# Altium project CompassIO_Rev2.PrjPcb
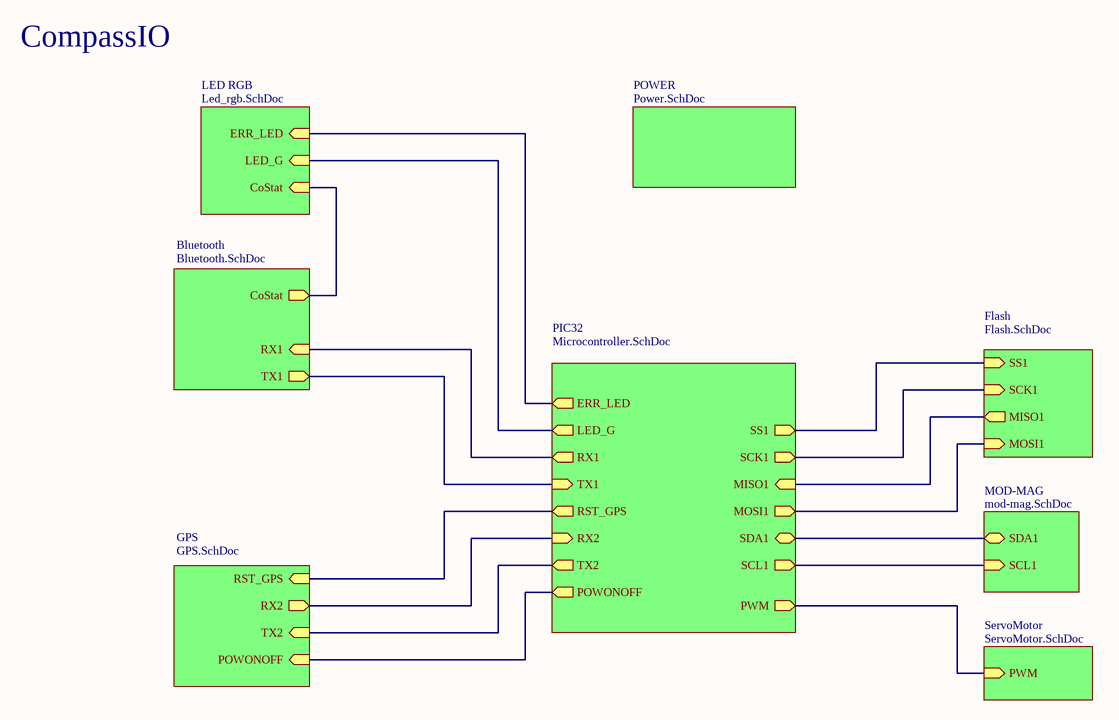
[diagram p0: CompassIO.SchDoc]
9 sheets, 58 parts. Net scope: hierarchical (ports join the sheet entries above them; power ports are global).
Board file: PCB2.PcbDoc
Sheets:
  CompassIO.SchDoc
    Bluetooth = Bluetooth.SchDoc
    PIC32 = Microcontroller.SchDoc
    GPS = GPS.SchDoc
    MOD-MAG = mod-mag.SchDoc
    Flash = Flash.SchDoc
    ServoMotor = ServoMotor.SchDoc
    LED RGB = Led_rgb.SchDoc
    POWER = Power.SchDoc

## Sheet CompassIO.SchDoc
size A4; SheetNumber: 0

### Sub-sheets
Bluetooth = Bluetooth.SchDoc: CoStat (out), RX1 (in), TX1 (out)
Flash = Flash.SchDoc: SS1 (in), SCK1 (in), MISO1 (out), MOSI1 (in)
GPS = GPS.SchDoc: RST_GPS (in), TX2 (in), RX2 (out), POWONOFF (in)
LED RGB = Led_rgb.SchDoc: LED_G (in), CoStat (in), ERR_LED (in)
MOD-MAG = mod-mag.SchDoc: SDA1 (bidir), SCL1 (in)
PIC32 = Microcontroller.SchDoc: POWONOFF (out), RX2 (in), TX2 (out), RST_GPS (out), LED_G (out), RX1 (out), TX1 (in), SS1 (out), SCK1 (out), MISO1 (in), MOSI1 (out), SDA1 (bidir), PWM (out), SCL1 (out), ERR_LED (out)
POWER = Power.SchDoc: no entries
ServoMotor = ServoMotor.SchDoc: PWM (in)

### Nets
NetJ2_13: sheet Bluetooth/TX1, sheet PIC32/TX1
NetJ2_14: sheet Bluetooth/RX1, sheet PIC32/RX1
NetJ2_21: sheet Bluetooth/CoStat, sheet LED RGB/CoStat
NetJ4_5: sheet PIC32/SCL1, sheet MOD-MAG/SCL1
NetJ4_6: sheet PIC32/SDA1, sheet MOD-MAG/SDA1
NetJ5_1: sheet PIC32/RST_GPS, sheet GPS/RST_GPS
NetJ5_18: sheet PIC32/POWONOFF, sheet GPS/POWONOFF
NetJ5_20: sheet PIC32/RX2, sheet GPS/RX2
NetJ5_21: sheet PIC32/TX2, sheet GPS/TX2
NetM1_3: sheet PIC32/PWM, sheet ServoMotor/PWM
NetR12_1: sheet PIC32/LED_G, sheet LED RGB/LED_G
NetR13_1: sheet PIC32/ERR_LED, sheet LED RGB/ERR_LED
NetU1_22: sheet PIC32/MISO1, sheet Flash/MISO1
NetU1_24: sheet PIC32/MOSI1, sheet Flash/MOSI1
NetU1_25: sheet PIC32/SCK1, sheet Flash/SCK1
NetU1_26: sheet PIC32/SS1, sheet Flash/SS1

### Notes on the sheet
- CompassIO

## Sheet Bluetooth.SchDoc
size A4; SheetNumber: 3
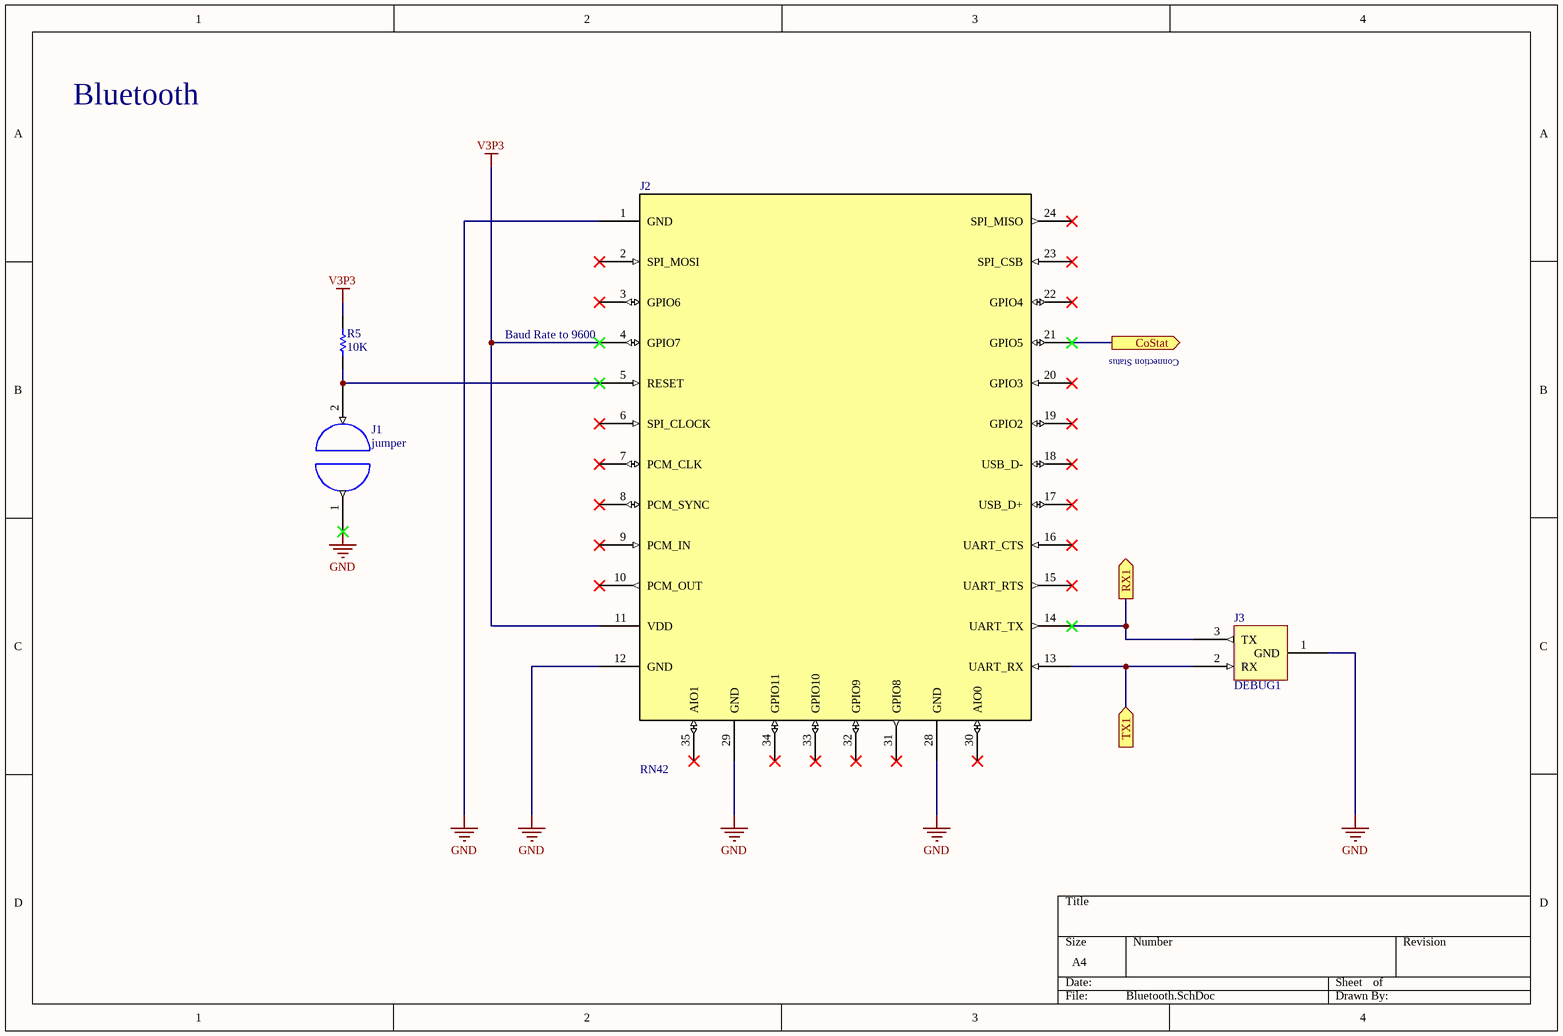
[diagram p1: Bluetooth.SchDoc]

### Parts
J1  jumper  [jumper 254]
J2  RN42  [RN42]
J3  DEBUG1  [DEBUG3]
R5  10K  [own_0603]

### Ports
CoStat (out), RX1 (out), TX1 (in)

### Nets
GND: J1.1 J2.1(GND) J2.12(GND) J2.28(GND) J2.29(GND) J3.1(GND)
V3P3: J2.4(GPIO7) J2.11(VDD) R5.2
NetJ1_2: J1.2 J2.5(RESET) R5.1
NetJ2_13: J2.13(UART_RX) J3.2(RX) ; port TX1
NetJ2_14: J2.14(UART_TX) J3.3(TX) ; port RX1
NetJ2_21: J2.21(GPIO5) ; port CoStat

Not connected (* = marked no-connect by the designer): J2 2(SPI_MOSI)* 3(GPIO6)* 6(SPI_CLOCK)* 7(PCM_CLK)* 8(PCM_SYNC)* 9(PCM_IN)* 10(PCM_OUT)* 15(UART_RTS)* 16(UART_CTS)* 17(USB_D+)* 18(USB_D-)* 19(GPIO2)* 20(GPIO3)* 22(GPIO4)* 23(SPI_CSB)* 24(SPI_MISO)* 30(AIO0)* 31(GPIO8)* 32(GPIO9)* 33(GPIO10)* 34(GPIO11)* 35(AIO1)*

### Notes on the sheet
- Bluetooth
- (near J2) Baud Rate to 9600
- Connection Status

### Library data of the parts
J2 = RN42: Bluetooth Module; Fabricant: Microchip; RefFabricant: RN42-I/RM; Fournisseur: Farnell; RefFournisseur: 2143310
J3 = TTL_Debug_3: Debug interface
R5 = Res1: Resistor; Fournisseur: Farnell; Fabricant: PANASONIC ELECTRONIC COMPONENTS; RefFabricant: ERA3ARW103V; RefFournisseur: 1688472

## Sheet Microcontroller.SchDoc
size A4; SheetNumber: 1
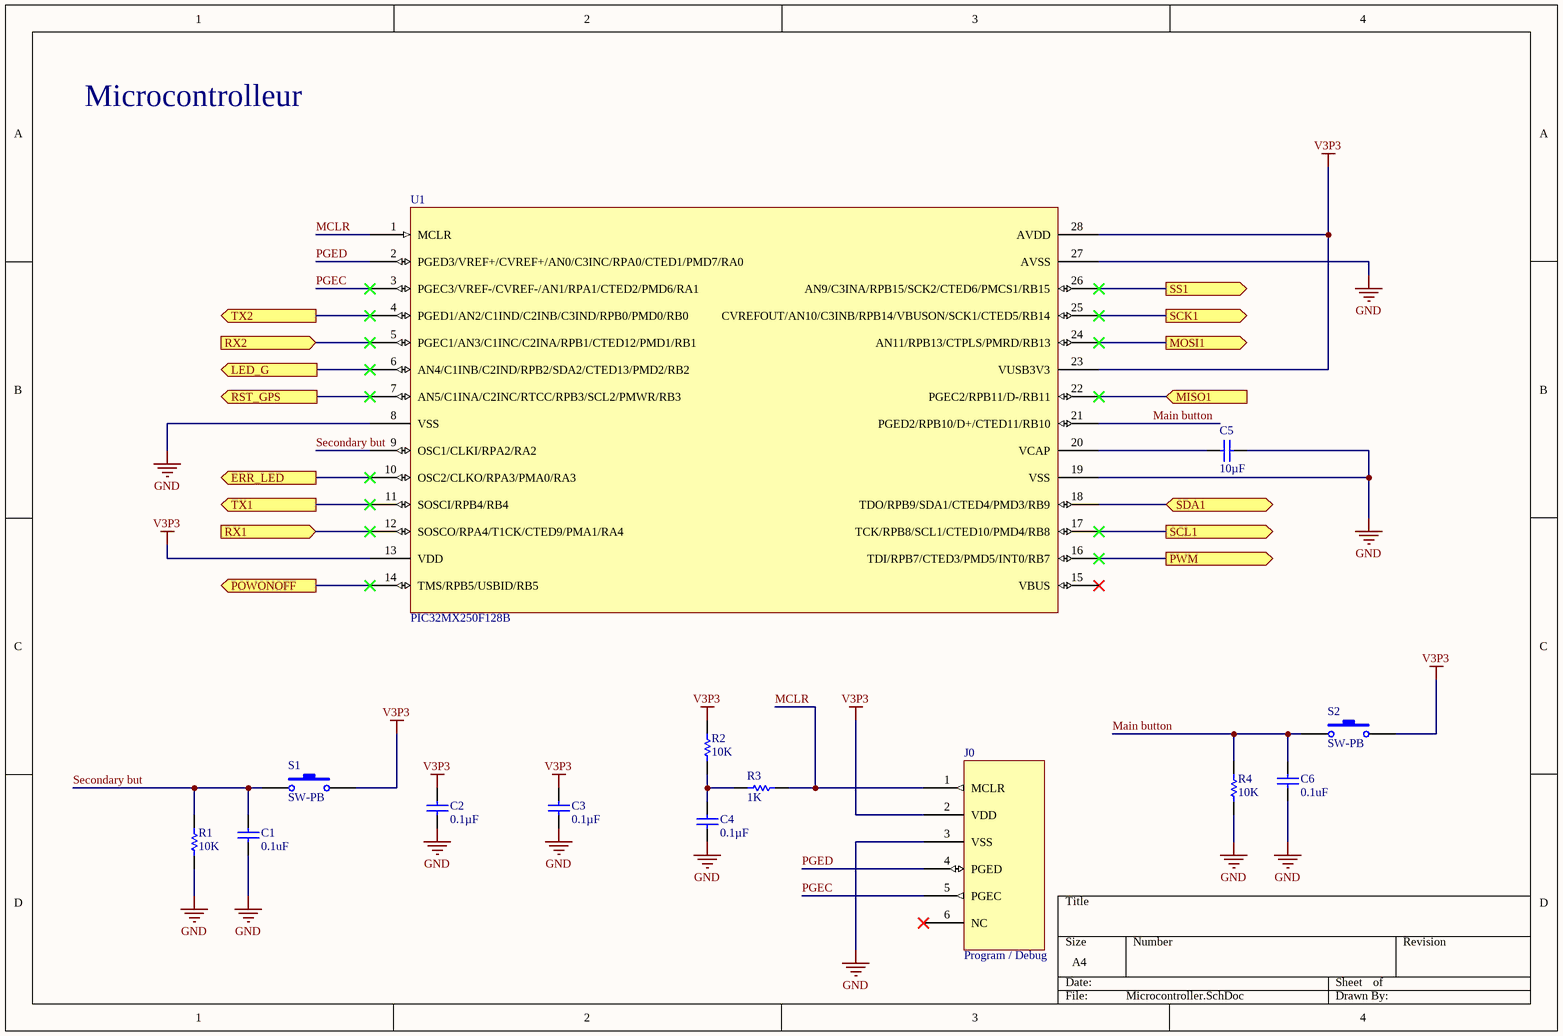
[diagram p2: Microcontroller.SchDoc]

### Parts
C1  0.1uF  [own_0603]
C2  0.1µF  [own_0603]
C3  0.1µF  [own_0603]
C4  0.1µF  [own_0603]
C5  10µF  [own_0603]
C6  0.1uF  [own_0603]
J0  Program / Debug  [C-Grid III X6]
R1  10K  [own_0603]
R2  10K  [own_0603]
R3  1K  [own_0603]
R4  10K  [own_0603]
S1  SW-PB  [SWTCH 1]
S2  SW-PB  [SWTCH 1]
U1  PIC32MX250F128B  [PIC32MX250F128/SO]

### Ports
ERR_LED (out), LED_G (out), MISO1 (in), MOSI1 (out), POWONOFF (out), PWM (out), RST_GPS (out), RX1 (in), RX2 (in), SCK1 (out), SCL1 (out), SDA1 (bidir), SS1 (out), TX1 (out), TX2 (out)

### Nets
GND: C1.1 C2.1 C3.1 C4.1 C5.1 C6.1 J0.3(VSS) R1.1 R4.1 U1.8(VSS) U1.19(VSS) U1.27(AVSS)
V3P3: C2.2 C3.2 J0.2(VDD) R2.2 S1.2 S2.2 U1.13(VDD) U1.23(VUSB3V3) U1.28(AVDD)
Main button: C6.2 R4.2 S2.1 U1.21(PGED2/RPB10/D+/CTED11/RB10)
MCLR: J0.1(MCLR) R3.2 U1.1(MCLR)
PGEC: J0.5(PGEC) U1.3(PGEC3/VREF-/CVREF-/AN1/RPA1/CTED2/PMD6/RA1)
PGED: J0.4(PGED) U1.2(PGED3/VREF+/CVREF+/AN0/C3INC/RPA0/CTED1/PMD7/RA0)
Secondary but: C1.2 R1.2 S1.1 U1.9(OSC1/CLKI/RPA2/RA2)
NetC4_2: C4.2 R2.1 R3.1
NetC5_2: C5.2 U1.20(VCAP)
NetJ2_13: U1.11(SOSCI/RPB4/RB4) ; port TX1
NetJ2_14: U1.12(SOSCO/RPA4/T1CK/CTED9/PMA1/RA4) ; port RX1
NetJ4_5: U1.17(TCK/RPB8/SCL1/CTED10/PMD4/RB8) ; port SCL1
NetJ4_6: U1.18(TDO/RPB9/SDA1/CTED4/PMD3/RB9) ; port SDA1
NetJ5_1: U1.7(AN5/C1INA/C2INC/RTCC/RPB3/SCL2/PMWR/RB3) ; port RST_GPS
NetJ5_18: U1.14(TMS/RPB5/USBID/RB5) ; port POWONOFF
NetJ5_20: U1.5(PGEC1/AN3/C1INC/C2INA/RPB1/CTED12/PMD1/RB1) ; port RX2
NetJ5_21: U1.4(PGED1/AN2/C1IND/C2INB/C3IND/RPB0/PMD0/RB0) ; port TX2
NetM1_3: U1.16(TDI/RPB7/CTED3/PMD5/INT0/RB7) ; port PWM
NetR12_1: U1.6(AN4/C1INB/C2IND/RPB2/SDA2/CTED13/PMD2/RB2) ; port LED_G
NetR13_1: U1.10(OSC2/CLKO/RPA3/PMA0/RA3) ; port ERR_LED
NetU1_22: U1.22(PGEC2/RPB11/D-/RB11) ; port MISO1
NetU1_24: U1.24(AN11/RPB13/CTPLS/PMRD/RB13) ; port MOSI1
NetU1_25: U1.25(CVREFOUT/AN10/C3INB/RPB14/VBUSON/SCK1/CTED5/RB14) ; port SCK1
NetU1_26: U1.26(AN9/C3INA/RPB15/SCK2/CTED6/PMCS1/RB15) ; port SS1

Not connected (* = marked no-connect by the designer): J0 6(NC)*; U1 15(VBUS)*

### Notes on the sheet
- Microcontrolleur

### Library data of the parts
C1 = Cap: Capacitor; Value: 10uF; RefFabricant: 0603YC104KAZ2A; Fournisseur: Farnell; Fabricant: AVX
C2 C3 = Cap: Capacitor; RefFabricant: 0603YC104KAZ2A; Fournisseur: Farnell; Fabricant: AVX; RefFournisseur: 7569556; Value: 0.1µF
C4 = Cap: Capacitor; RefFabricant: 0603YC104KAZ2A; Fabricant: AVX; Fournisseur: Farnell; RefFournisseur: 7569556; Value: 0.1µF
C5 = Cap: Capacitor; Fournisseur: Farnell; Fabricant: MURATA; RefFabricant: GRM188R60J106KE47D; RefFournisseur: 2494230; Value: 10µF
C6 = Cap: Capacitor; Value: 10uF; RefFabricant: 0603YC104KAZ2A; Fournisseur: Farnell; Fabricant: AVX; RefFournisseur: 7569556
J0 = ICSP: Fabricant: Molex; Fournisseur: Farnell; RefFournisseur: 9731172; RefFabricant: 22-27-2061
R1 R2 R4 = Res1: as R5 on sheet Bluetooth
R3 = Res1: Resistor; Fabricant: PANASONIC ELECTRONIC COMPONENTS; Fournisseur: Farnell; RefFabricant: ERA3ARB102V; RefFournisseur: 1717570; Value: 1K
S1 S2 = SW-PB: Switch; Fabricant: ALCOSWITCH - TE CONNECTIVITY; Fournisseur: Farnell; RefFabricant: 1437566-3; RefFournisseur: 2468741
U1 = PIC32MX250F128B: Microcontrolleur; Fabricant: Microchip; RefFabricant: PIC32MX250F128B-I/SO; Fournisseur: Farnell; RefFournisseur: 2097772

## Sheet GPS.SchDoc
size A4; SheetNumber: 4
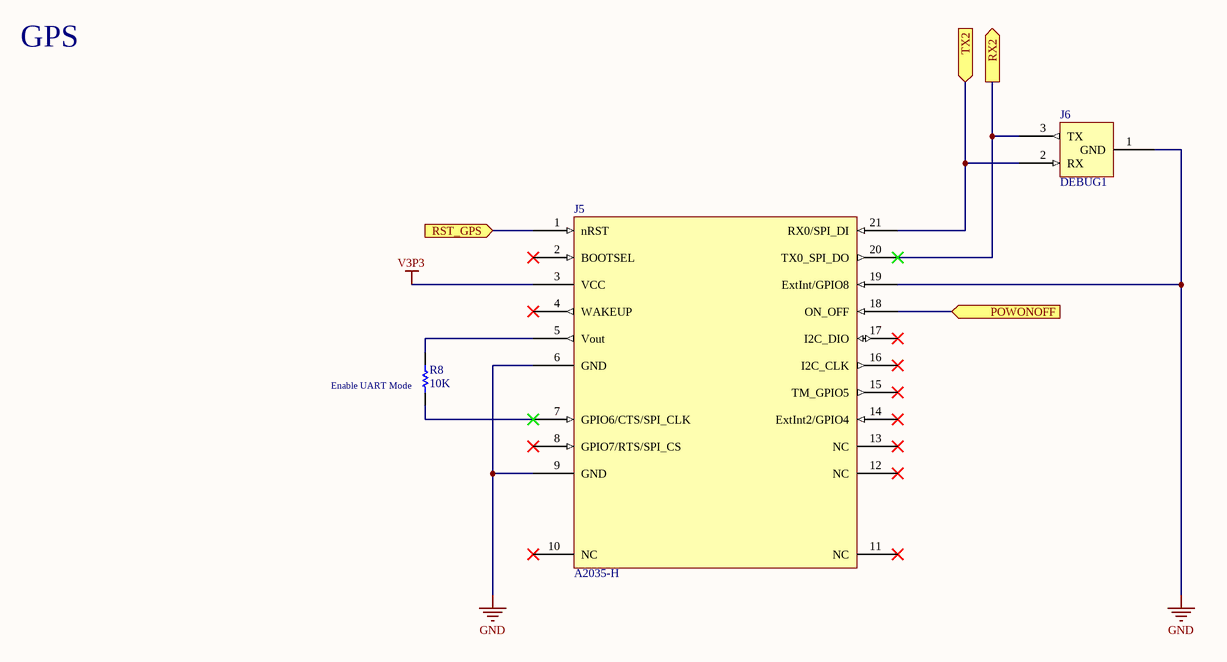
[diagram p3: GPS.SchDoc]

### Parts
J5  A2035-H  [A2035-H]
J6  DEBUG1  [DEBUG3]
R8  10K  [own_0603]

### Ports
POWONOFF (in), RST_GPS (in), RX2 (out), TX2 (in)

### Nets
GND: J5.6(GND) J5.9(GND) J5.19(ExtInt/GPIO8) J6.1(GND)
V3P3: J5.3(VCC)
NetJ5_1: J5.1(nRST) ; port RST_GPS
NetJ5_5: J5.5(Vout) R8.2
NetJ5_7: J5.7(GPIO6/CTS/SPI_CLK) R8.1
NetJ5_18: J5.18(ON_OFF) ; port POWONOFF
NetJ5_20: J5.20(TX0_SPI_DO) J6.3(TX) ; port RX2
NetJ5_21: J5.21(RX0/SPI_DI) J6.2(RX) ; port TX2

Not connected (* = marked no-connect by the designer): J5 2(BOOTSEL)* 4(WAKEUP)* 8(GPIO7/RTS/SPI_CS)* 10(NC)* 11(NC)* 12(NC)* 13(NC)* 14(ExtInt2/GPIO4)* 15(TM_GPIO5)* 16(I2C_CLK)* 17(I2C_DIO)*

### Notes on the sheet
- GPS
- (near R8) Enable UART Mode

### Library data of the parts
J5 = A2035-H: GPS Module; Fabricant: MAESTRO WIRELESS SOLUTIONS; RefFabricant: A2035H; Fournisseur: Farnell; RefFournisseur: 2281693
J6 = TTL_Debug_3: Debug interface
R8 = Res1: as R5 on sheet Bluetooth

## Sheet mod-mag.SchDoc
size A4; SheetNumber: 2
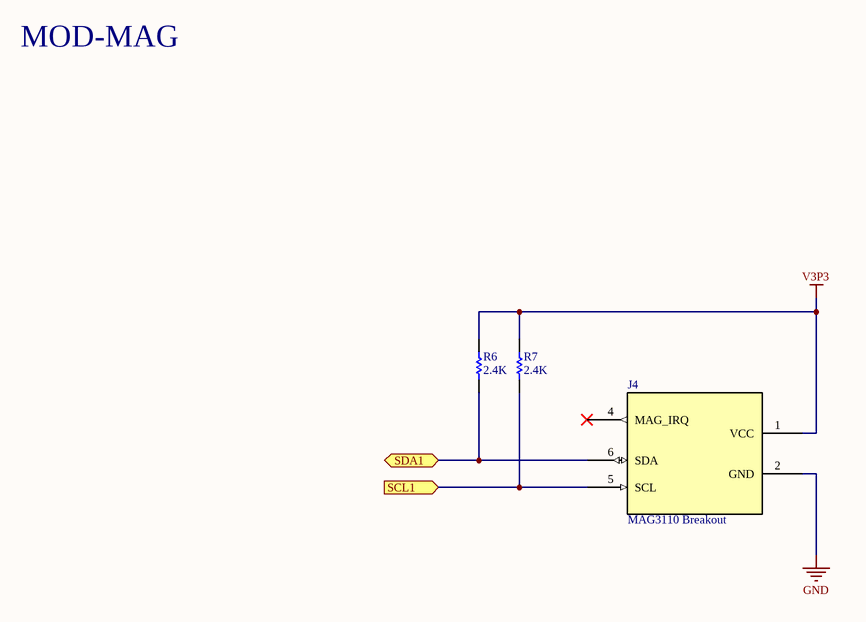
[diagram p4: mod-mag.SchDoc]

### Parts
J4  MAG3110 Breakout  [UEXT_MALE x10]
R6  2.4K  [own_0603]
R7  2.4K  [own_0603]

### Ports
SCL1 (in), SDA1 (bidir)

### Nets
GND: J4.2(GND)
V3P3: J4.1(VCC) R6.2 R7.2
NetJ4_5: J4.5(SCL) R7.1 ; port SCL1
NetJ4_6: J4.6(SDA) R6.1 ; port SDA1

Not connected (* = marked no-connect by the designer): J4 4(MAG_IRQ)*

### Notes on the sheet
- MOD-MAG

### Library data of the parts
J4 = MOD-MAG3110: Fournisseur: Farnell; RefFabricant: 5103310-1; Fabricant: AMP - TE Connectvity; RefFournisseur: 2452436
R6 R7 = Res1: Resistor; Value: 2K4; Fournisseur: Farnell; Fabricant: VISHAY; RefFabricant: CRCW06032K40FKEA; RefFournisseur: 1469766

## Sheet Flash.SchDoc
size A4; SheetNumber: 5
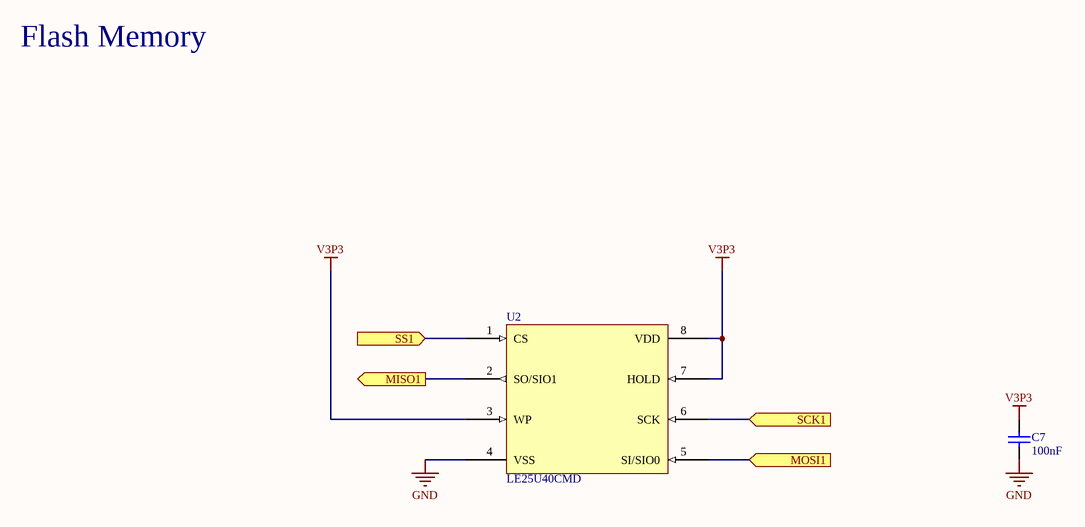
[diagram p5: Flash.SchDoc]

### Parts
C7  100nF  [own_0603]
U2  LE25U40CMD  [LE25U40CMDTWG]

### Ports
MISO1 (out), MOSI1 (in), SCK1 (in), SS1 (in)

### Nets
GND: C7.1 U2.4(VSS)
V3P3: C7.2 U2.3(WP) U2.7(HOLD) U2.8(VDD)
NetU1_22: U2.2(SO/SIO1) ; port MISO1
NetU1_24: U2.5(SI/SIO0) ; port MOSI1
NetU1_25: U2.6(SCK) ; port SCK1
NetU1_26: U2.1(CS) ; port SS1

### Notes on the sheet
- Flash Memory

### Library data of the parts
C7 = Cap: Capacitor; Value: 100pF; Fabricant: AVX; Fournisseur: Farnell; RefFournisseur: 7569556; RefFabricant: 0603YC104KAZ2A
U2 = LE25U40CMD: Flash memory; Fabricant: On Semiconductor; Fournisseur: Farnell; RefFournisseur: 2627898; RefFabricant: LE25U40CMDTWG

## Sheet ServoMotor.SchDoc
size A4; SheetNumber: 7
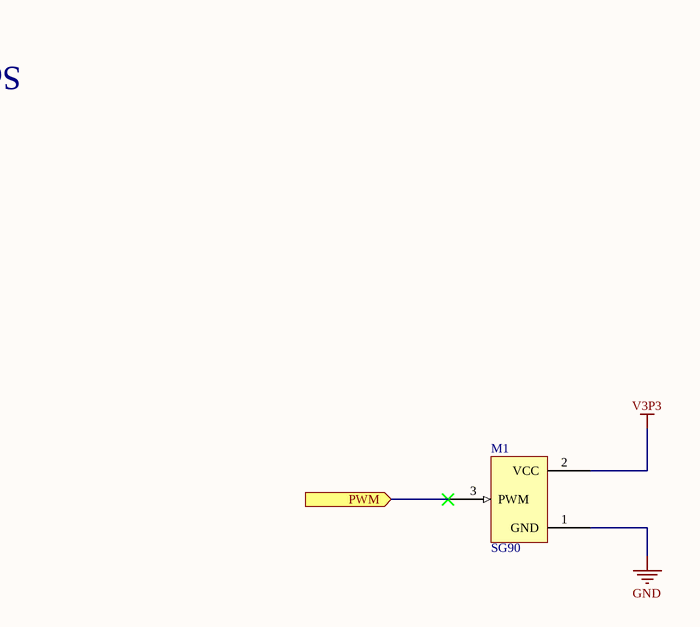
[diagram p6: ServoMotor.SchDoc]

### Parts
M1  SG90  [C-Grid III x3]

### Ports
PWM (in)

### Nets
GND: M1.1(GND)
V3P3: M1.2(VCC)
NetM1_3: M1.3(PWM) ; port PWM

### Notes on the sheet
- Servomotor

### Library data of the parts
M1 = SG90: Servo motor; Fabricant: Molex; Fournisseur: Farnell; RefFournisseur: 9731156; RefFabricant: 22-27-2031

## Sheet Led_rgb.SchDoc
size A4; SheetNumber: 6
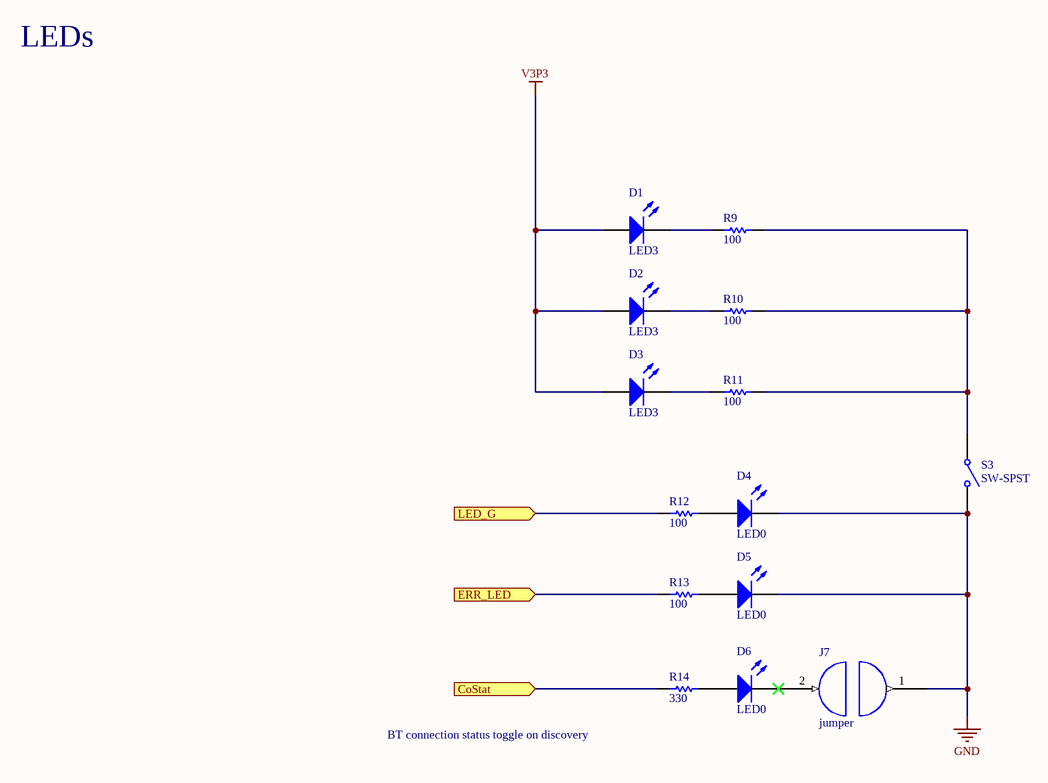
[diagram p7: Led_rgb.SchDoc]

### Parts
D1  LED3  [1608 led]
D2  LED3  [1608 led]
D3  LED3  [1608 led]
D4  LED0  [1608 led]
D5  LED0  [20125 led]
D6  LED0  [1608 led]
J7  jumper  [jumper 254]
R9  100  [own_0603]
R10  100  [own_0603]
R11  100  [own_0603]
R12  100  [own_0603]
R13  100  [own_0603]
R14  330  [own_0603]
S3  SW-SPST  [SPST-2]

### Ports
CoStat (in), ERR_LED (in), LED_G (in)

### Nets
GND: D4.2(K) D5.2(K) J7.1 S3.2(NO)
V3P3: D1.1(A) D2.1(A) D3.1(A)
NetD1_2: D1.2(K) R9.1
NetD2_2: D2.2(K) R10.1
NetD3_2: D3.2(K) R11.1
NetD4_1: D4.1(A) R12.2
NetD5_1: D5.1(A) R13.2
NetD6_1: D6.1(A) R14.1
NetD6_2: D6.2(K) J7.2
NetJ2_21: R14.2 ; port CoStat
NetR9_2: R9.2 R10.2 R11.2 S3.1(COMMON)
NetR12_1: R12.1 ; port LED_G
NetR13_1: R13.1 ; port ERR_LED

### Notes on the sheet
- LEDs
- BT connection status toggle on discovery

### Library data of the parts
D1-D3 = LED3: Typical BLUE SiC LED; Fabricant: ROHM; RefFabricant: SMLE13WBC8W1; Fournisseur: Farnell; RefFournisseur: 2762565
D4 = LED0: Typical INFRARED GaAs LED; Fabricant: KINGBRIGHT; Fournisseur: Farnell; RefFabricant: KPH-1608SGC; RefFournisseur: 2426215
D5 = LED0: Typical INFRARED GaAs LED; RefFabricant: KP-2012EC; Fournisseur: Farnell; Fabricant: KINGBRIGHT; RefFournisseur: 8529949
D6 = LED0: Typical INFRARED GaAs LED; Fournisseur: Farnell; Fabricant: KINGBRIGHT; RefFabricant: KPT-1608LVVBC-D; RefFournisseur: 2610410
R9-R13 = Res1: Resistor; Value: 1K; Fabricant: VISHAY; Fournisseur: Farnell; RefFabricant: CRCW0603100RJNEA; RefFournisseur: 2616742
R14 = Res1: Resistor; Fournisseur: Farnell; Fabricant: PANASONIC ELECTRONIC COMPONENTS; RefFabricant: ERJ3GEYJ331V; RefFournisseur: 2059588; Value: 330
S3 = SW-SPST: Single-Pole, Single-Throw Switch

## Sheet Power.SchDoc
size A4; SheetNumber: 8
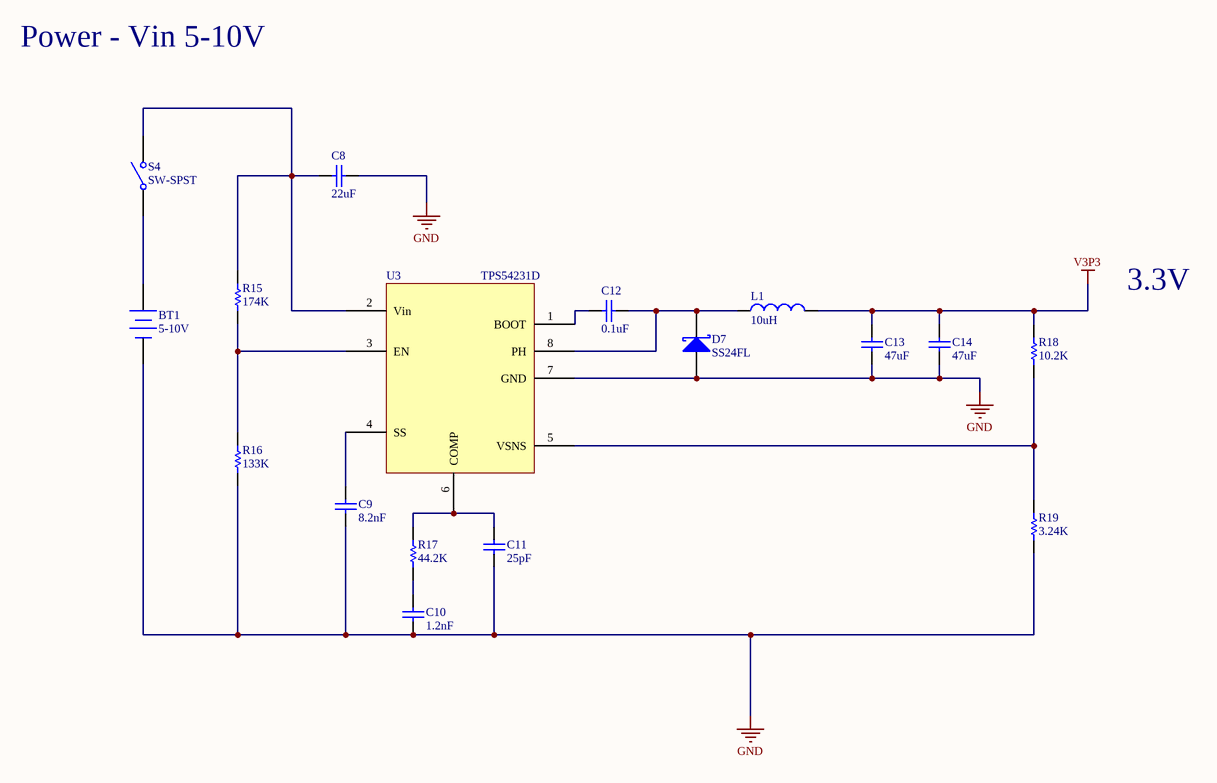
[diagram p8: Power.SchDoc]

### Parts
BT1  5-10V  [BAT-2]
C8  22uF  [own_0603]
C9  8.2nF  [own_0603]
C10  1.2nF  [own_0603]
C11  25pF  [own_0603]
C12  0.1uF  [own_0603]
C13  47uF  [Own_0805]
C14  47uF  [Own_0805]
D7  SS24FL  [ShotkyCMS]
L1  10uH  [Inductor CMS]
R15  174K  [own_0603]
R16  133K  [own_0603]
R17  44.2K  [own_0603]
R18  10.2K  [own_0603]
R19  3.24K  [own_0603]
S4  SW-SPST  [SPST-2]
U3  TPS54231D  [R-PDSO-G8]

### Nets
GND: BT1.2(-) C8.2 C9.1 C10.1 C11.1 C13.1 C14.1 D7.2(A) R16.2 R19.2 U3.7(GND)
V3P3: C13.2 C14.2 L1.2 R18.1
NetBT1_1: BT1.1(+) S4.1(COMMON)
NetC8_1: C8.1 R15.1 S4.2(NO) U3.2(Vin)
NetC9_2: C9.2 U3.4(SS)
NetC10_2: C10.2 R17.2
NetC11_2: C11.2 R17.1 U3.6(COMP)
NetC12_1: C12.1 D7.1(K) L1.1 U3.8(PH)
NetC12_2: C12.2 U3.1(BOOT)
NetR15_2: R15.2 R16.1 U3.3(EN)
NetR18_2: R18.2 R19.1 U3.5(VSNS)

### Notes on the sheet
- Power - Vin 5-10V
- 3.3V

### Library data of the parts
BT1 = Battery: 4xAA
C8 = Cap: Capacitor; Fabricant: MURATA; RefFabricant: GRM188R61A226ME15D; Fournisseur: Farnell; RefFournisseur: 2666496; Value: 22uF
C9 = Cap: Capacitor; Fournisseur: Farnell; Fabricant: MULTICOMP; RefFabricant: MC0603B822K500CT; RefFournisseur: 1759101; Value: 8.2nF
C10 = Cap: Capacitor; RefFabricant: 0603B122K500CT; Fabricant: Walsin; Fournisseur: Farnell; RefFournisseur: 2524822; Value: 1.2nF
C11 = Cap: Capacitor; Fabricant: WALSIN; RefFabricant: 0603N250J500CT; Fournisseur: Farnell; RefFournisseur: 2524884; Value: 25pF
C12 = Cap: Capacitor; RefFabricant: 0603YC104KAZ2A; RefFournisseur: 7569556; Fabricant: AVX; Fournisseur: Farnell; Value: 0.1uF
C13 C14 = Cap: Capacitor; RefFabricant: GRM21BR60J476ME15L; Fournisseur: Farnell; Fabricant: MURATA; RefFournisseur: 2362109; Value: 47uF
D7 = Diode 10TQ035: Schottky Rectifier; Fabricant: ON SEMICONDUCTOR; Fournisseur: Farnell; RefFournisseur: 2822566; RefFabricant: SS24FL
L1 = Inductor: Fabricant: BOURNS; RefFabricant: SRN8040-100M; Fournisseur: Farnell; RefFournisseur: 2061669; Value: 10uH
R15 = Res1: Resistor; Fabricant: VISHAY; Fournisseur: Farnell; RefFabricant: CRCW0603174KFKEA; RefFournisseur: 2138522; Value: 174K
R16 = Res1: Resistor; Fabricant: MULTICOMP; Fournisseur: Farnell; RefFabricant: MCWR06X1333FTL; RefFournisseur: 2694713; Value: 133K
R17 = Res1: Resistor; Fabricant: VISHAY; Fournisseur: Farnell; RefFabricant: CRCW060344K2FKEA; RefFournisseur: 2138466; Value: 44.2K
R18 = Res1: Resistor; Fournisseur: Farnell; Fabricant: PANASONIC ELECTRONIC COMPONENTS; RefFabricant: ERJ3EKF1022V; RefFournisseur: 2059407; Value: 10.2K
R19 = Res1: Resistor; Fournisseur: Farnell; Fabricant: VISHAY; RefFabricant: CRCW06033K24FKEA; RefFournisseur: 1652877; Value: 3.24K
S4 = SW-SPST: Single-Pole, Single-Throw Switch; RefFabricant: H8600VBAAA; Fabricant: Arcolectric; Fournisseur: Farnell; RefFournisseur: 151133
U3 = TPS54231D: Buck SD 3.3V; Fabricant: Texas Instruments; Fournisseur: Farnell; RefFournisseur: 2854681; RefFabricant: TPS54231D

## Nets that join several sheets
GND: Bluetooth (6 pins), Microcontroller (12 pins), GPS (J5.6 J5.9 J5.19 J6.1), mod-mag (J4.2), Flash (C7.1 U2.4), ServoMotor (M1.1), Led_rgb (D4.2 D5.2 J7.1 S3.2), Power (11 pins)
V3P3: Bluetooth (J2.4 J2.11 R5.2), Microcontroller (9 pins), GPS (J5.3), mod-mag (J4.1 R6.2 R7.2), Flash (C7.2 U2.3 U2.7 U2.8), ServoMotor (M1.2), Led_rgb (D1.1 D2.1 D3.1), Power (C13.2 C14.2 L1.2 R18.1)
NetJ2_13: Bluetooth (J2.13 J3.2), Microcontroller (U1.11)
NetJ2_14: Bluetooth (J2.14 J3.3), Microcontroller (U1.12)
NetJ2_21: Bluetooth (J2.21), Led_rgb (R14.2)
NetJ4_5: Microcontroller (U1.17), mod-mag (J4.5 R7.1)
NetJ4_6: Microcontroller (U1.18), mod-mag (J4.6 R6.1)
NetJ5_1: Microcontroller (U1.7), GPS (J5.1)
NetJ5_18: Microcontroller (U1.14), GPS (J5.18)
NetJ5_20: Microcontroller (U1.5), GPS (J5.20 J6.3)
NetJ5_21: Microcontroller (U1.4), GPS (J5.21 J6.2)
NetM1_3: Microcontroller (U1.16), ServoMotor (M1.3)
NetR12_1: Microcontroller (U1.6), Led_rgb (R12.1)
NetR13_1: Microcontroller (U1.10), Led_rgb (R13.1)
NetU1_22: Microcontroller (U1.22), Flash (U2.2)
NetU1_24: Microcontroller (U1.24), Flash (U2.5)
NetU1_25: Microcontroller (U1.25), Flash (U2.6)
NetU1_26: Microcontroller (U1.26), Flash (U2.1)